# Altium project Amplifier.PrjPcb
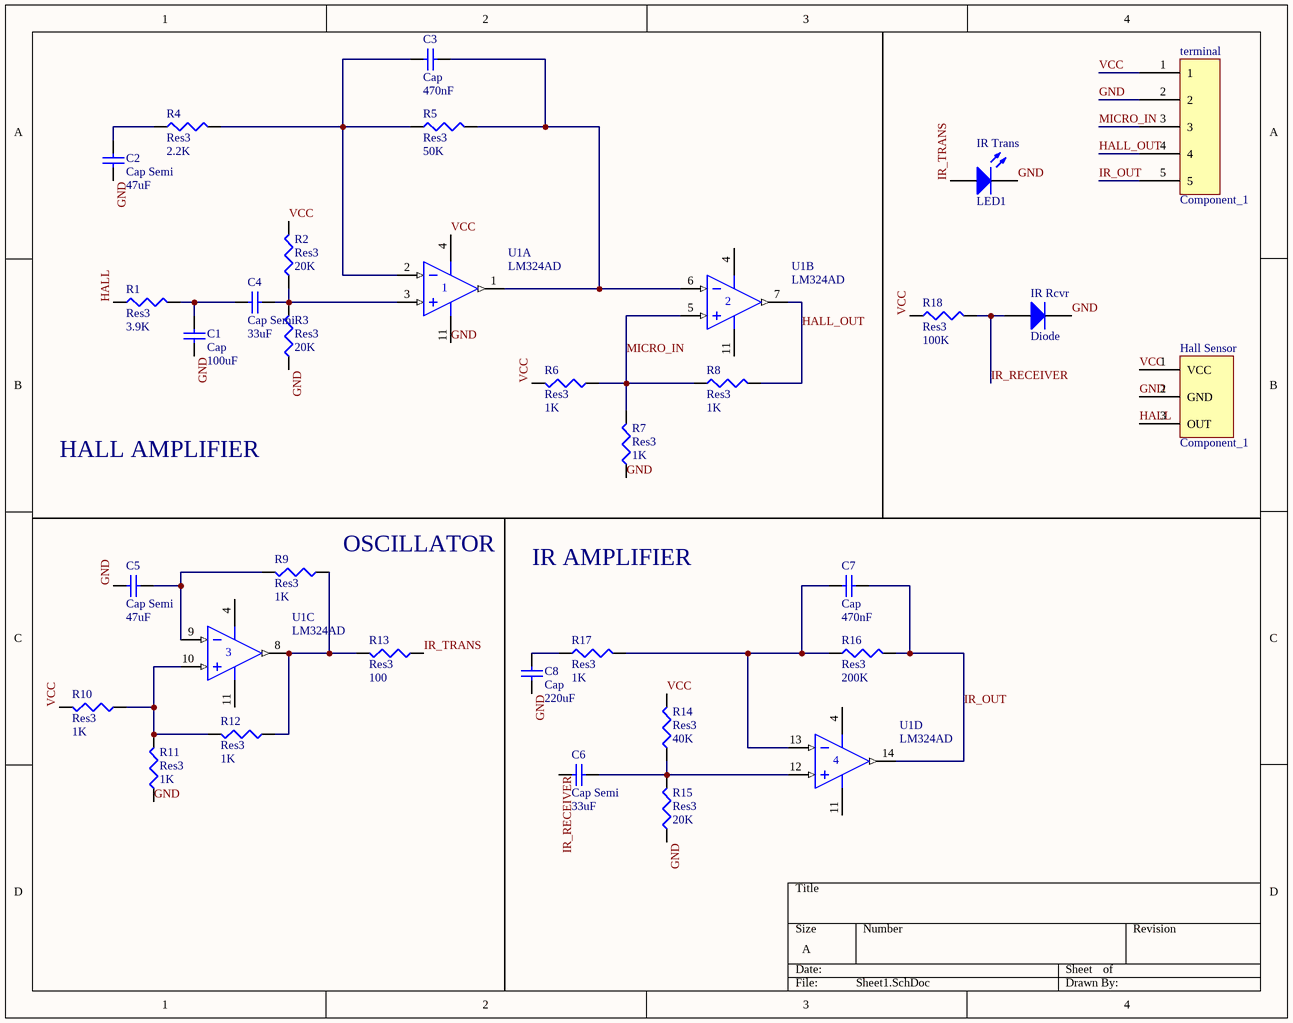
[diagram p0: Sheet1.SchDoc]
1 sheet, 31 parts. Net scope: global (net labels, ports and power ports of the same name join across sheets).
Board file: PCB1.PcbDoc

## Sheet Sheet1.SchDoc
size A

### Parts
C1  Cap  value 100uF  [10TPB220M]
C2  Cap Semi  value 47uF  [C1206]
C3  Cap  value 470nF  [J1-0603]
C4  Cap Semi  value 33uF  [C1210]
C5  Cap Semi  value 47uF  [C1206]
C6  Cap Semi  value 33uF  [C1210]
C7  Cap  value 470nF  [J1-0603]
C8  Cap  value 220uF  [10TPB220M]
Hall_Sensor  Component_1  [PCBComponent_1]
IR_Rcvr  Diode  [PIN2]
IR_Trans  LED1  [PIN2]
R1  Res3  value 3.9K  [J1-0603]
R2  Res3  value 20K  [J1-0603]
R3  Res3  value 20K  [J1-0603]
R4  Res3  value 2.2K  [J1-0603]
R5  Res3  value 50K  [J1-0603]
R6  Res3  value 1K  [J1-0603]
R7  Res3  value 1K  [J1-0603]
R8  Res3  value 1K  [J1-0603]
R9  Res3  value 1K  [J1-0603]
R10  Res3  value 1K  [J1-0603]
R11  Res3  value 1K  [J1-0603]
R12  Res3  value 1K  [J1-0603]
R13  Res3  value 100  [J1-0603]
R14  Res3  value 40K  [J1-0603]
R15  Res3  value 20K  [J1-0603]
R16  Res3  value 200K  [J1-0603]
R17  Res3  value 1K  [J1-0603]
R18  Res3  value 100K  [J1-0603]
terminal  Component_1  [PCBComponent_1]
U1  LM324AD  [751A-03_N]  (parts A,B,C,D of 4)

### Nets
GND: C1.1 C2.1 C5.2 C8.1 Hall_Sensor.2(GND) IR_Rcvr.2(K) IR_Trans.2(K) R3.1 R7.1 R11.1 R15.1 terminal.2 U1.11(V-)
HALL: Hall_Sensor.3(OUT) R1.1
HALL_OUT: R8.2 terminal.4 U1.7(OUT2)
IR_OUT: C7.2 R16.2 terminal.5 U1.14(OUT4)
IR_RECEIVER: C6.1 IR_Rcvr.1(A) R18.2
IR_TRANS: IR_Trans.1(A) R13.1
MICRO_IN: R6.1 R7.2 R8.1 terminal.3 U1.5(IN2+)
VCC: Hall_Sensor.1(VCC) R2.2 R6.2 R10.2 R14.2 R18.1 terminal.1 U1.4(V+)
NetC1_2: C1.2 C4.1 R1.2
NetC2_2: C2.2 R4.1
NetC3_1: C3.1 R4.2 R5.1 U1.2(IN1-)
NetC3_2: C3.2 R5.2 U1.1(OUT1) U1.6(IN2-)
NetC4_2: C4.2 R2.1 R3.2 U1.3(IN1+)
NetC5_1: C5.1 R9.2 U1.9(IN3-)
NetC6_2: C6.2 R14.1 R15.2 U1.12(IN4+)
NetC7_1: C7.1 R16.1 R17.2 U1.13(IN4-)
NetC8_2: C8.2 R17.1
NetR9_1: R9.1 R12.1 R13.2 U1.8(OUT3)
NetR10_1: R10.1 R11.2 R12.2 U1.10(IN3+)

### Notes on the sheet
- HALL AMPLIFIER
- (near R9) OSCILLATOR
- IR AMPLIFIER

### Library data of the parts
C1 C3 C7 C8 = Cap: Capacitor; Published: 8-Jun-2000; LatestRevisionDate: 17-Jul-2002; LatestRevisionNote: Re-released for DXP Platform.; PackageReference: RAD-0.3; Publisher: Altium Limited; PackageDescription: Radial Cap, Thru-Hole; 2 Leads; 0.3 in Pin Spacing
C2 C4-C6 = Cap Semi: Capacitor (Semiconductor SIM Model); Published: 8-Jun-2000; LatestRevisionDate: 29-May-2009; LatestRevisionNote: IPC-7351 Footprint Added.; PackageReference: C1206; Publisher: Altium Limited; PackageDescription: Chip Capacitor
IR_Rcvr = Diode: Default Diode; Published: 8-Jun-2000; LatestRevisionDate: 17-Jul-2002; LatestRevisionNote: Re-released for DXP Platform.; PackageVersion: Sep-1996; PackageReference: SMC; Publisher: Altium Limited; PackageDescription: DO-214-AB/SMC; 2 C-Bend Leads; Body 7.9 x 5.9 mm, inc. leads (LxW); Code_JEDEC: DO-214-AB
IR_Trans = LED1: Typical RED GaAs LED; Published: 8-Jun-2000; LatestRevisionDate: 08-Jul-2005; LatestRevisionNote: Mech Layer 1 removed.; PackageReference: LED-1; Publisher: Altium Limited; PackageDescription: LED; 2 Leads
R1-R18 = Res3: Resistor; Published: 8-Jun-2000; LatestRevisionDate: 29-May-2009; LatestRevisionNote: IPC-7351 Footprint Added.; PackageReference: J1-0603; Publisher: Altium Limited; PackageDescription: Chip Resistor
U1 = LM324AD: Quad Differential Input, Low-Power Operational Amplifier; Published: 28-Feb-2003; LatestRevisionDate: 13-Apr-2006; LatestRevisionNote: IPC-7351 Footprint Added.; DatasheetVersion: Dec-2001, Rev. 7; PackageReference: 751A-03; Publisher: Altium Limited; PackageDescription: 14-Pin Small Outline Integrated Circuit 1.27 mm Pitch; Code_JEDEC: MS-012-AB; Code_IPC: SOIC127P600-14; ComponentLink1Description: Manufacturer Link; ComponentLink1URL: http://www.onsemi.com/; ComponentLink2Description: Datasheet; ComponentLink2URL: http://www.onsemi.com/pub/Collateral/LM324-D.PDF